# Altium project Blower_PCB.PrjPcb (part 1 of 2)
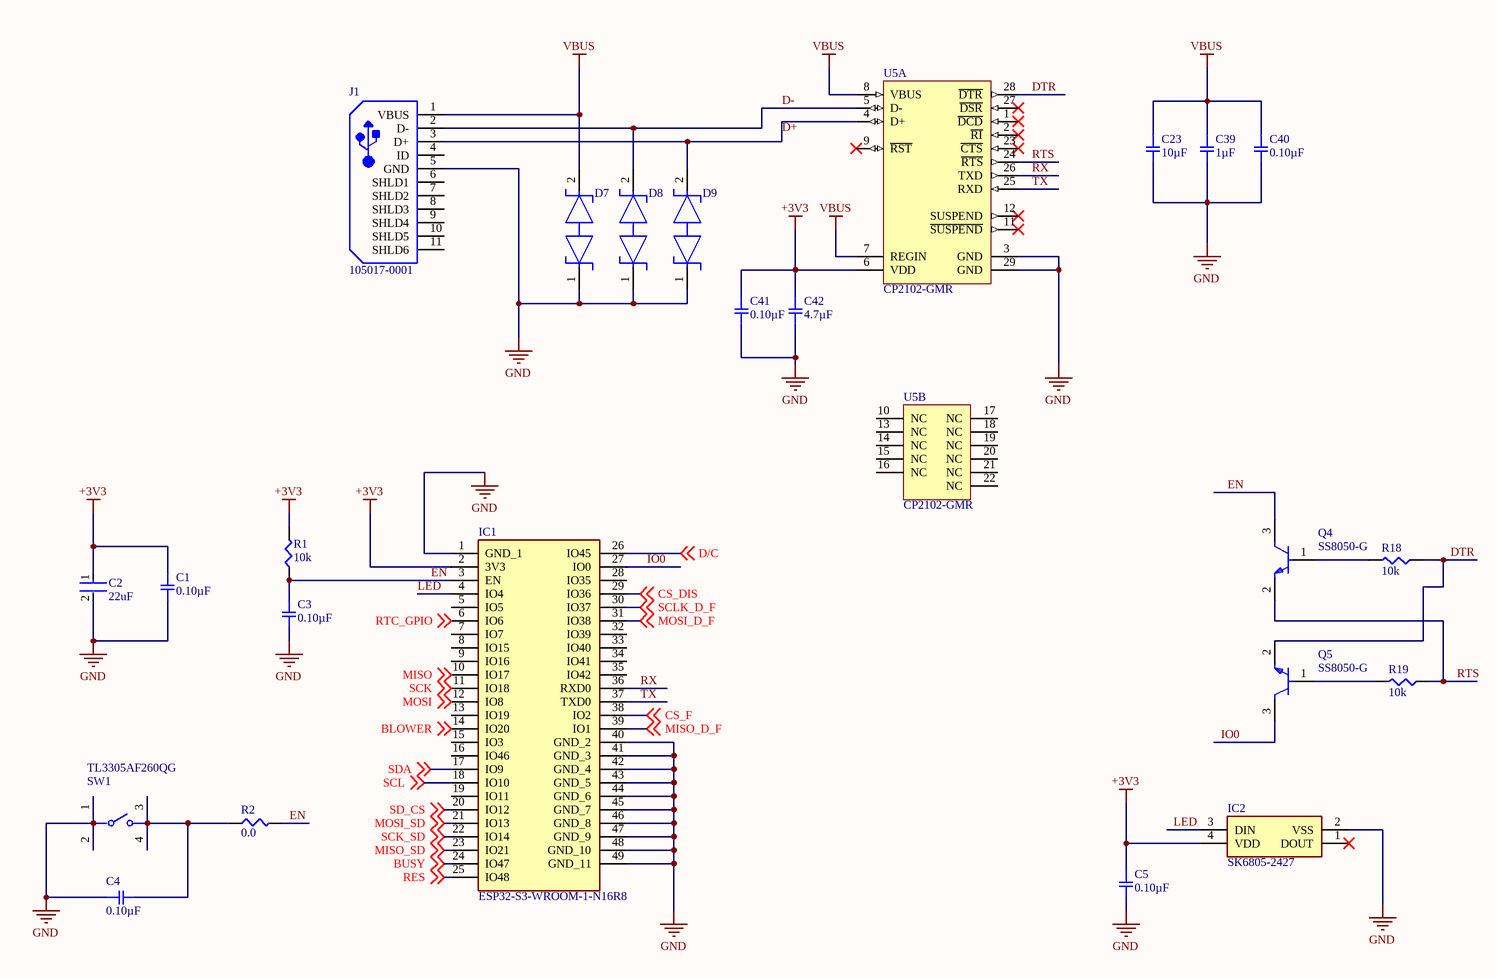
[diagram p0: MCU.SchDoc]
7 sheets, 136 parts. Net scope: global (net labels, ports and power ports of the same name join across sheets).
Board file: Copy of Blower_Pcb.PcbDoc
Sheets:
  MCU.SchDoc
  Sensor.SchDoc
  Other.SchDoc
  Display.SchDoc
  I2C_DRIVER.SchDoc
  RTC.SchDoc
  Power.SchDoc

## Sheet MCU.SchDoc
size 381 x 241 mm; SheetNumber: 1; SheetTotal: 7

### Parts
C1  0.10µF  [SMD-0402C]
C2  22uF  [FP-CL05A226MQ5N6J8-IPC_C]
C3  0.10µF  [SMD-0402C]
C4  0.10µF  [SMD-0402C]
C5  0.10µF  [SMD-0402C]
C23  10µF  [SMD-0402C]
C39  1µF  [SMD-0402C]
C40  0.10µF  [SMD-0402C]
C41  0.10µF  [SMD-0402C]
C42  4.7µF  [SMD-0402C]
D7  PD1E10B06DPYR  [FP-DPY0002A-MFG]  (value not drawn)
D8  PD1E10B06DPYR  [FP-DPY0002A-MFG]  (value not drawn)
D9  PD1E10B06DPYR  [FP-DPY0002A-MFG]  (value not drawn)
IC1  ESP32-S3-WROOM-1-N16R8  [ESP32S3WROOM1N16R8]
IC2  SK6805-2427  [SK68052427]
J1  105017-0001  [USB-MICRO-B_V]
Q4  SS8050-G  [FP-SS8050-G-MFG]
Q5  SS8050-G  [FP-SS8050-G-MFG]
R1  10k  [SMD-0402-RES]
R2  0.0  [SMD-0402-RES]
R18  10k  [SMD-0402-RES]
R19  10k  [SMD-0402-RES]
SW1  TL3305AF260QG  [FP-TL3305AF260QG-MFG]
U5  CP2102-GMR  [SLAB-QFN-28-3125x3125TP_M]  (parts A,B of 2)

### Nets
+3V3: C1.1 C2.1 C5.1 C41.1 C42.1 IC1.2(3V3) IC2.4(VDD) R1.2 U5.6(VDD)
GND: C1.2 C2.2 C3.2 C4.1 C5.2 C23.2 C39.2 C40.2 C41.2 C42.2 D7.1 D8.1 D9.1 IC1.1(GND_1) IC1.40(GND_2) IC1.41(GND_3) IC1.42(GND_4) IC1.43(GND_5) IC1.44(GND_6) IC1.45(GND_7) IC1.46(GND_8) IC1.47(GND_9) IC1.48(GND_10) IC1.49(GND_11) IC2.2(VSS) J1.5(GND) SW1.1 SW1.2 U5.3(GND) U5.29(GND)
VBUS: C23.1 C39.1 C40.1 D7.2 J1.1(VBUS) U5.7(REGIN) U5.8(VBUS)
BLOWER: IC1.14(IO20) ; off-sheet BLOWER
BUSY: IC1.24(IO47) ; off-sheet BUSY
CS_DIS: IC1.29(IO36) ; off-sheet CS_DIS
CS_F: IC1.38(IO2) ; off-sheet CS_F
D+: D9.2 J1.3(D+) U5.4(D+)
D-: D8.2 J1.2(D-) U5.5(D-)
D/C: IC1.26(IO45) ; off-sheet D/C
DTR: Q5.2(E) R18.1 U5.28(~{DTR})
EN: C3.1 IC1.3(EN) Q4.3(C) R1.1 R2.2
IO0: IC1.27(IO0) Q5.3(C)
LED: IC1.4(IO4) IC2.3(DIN)
MISO: IC1.10(IO17) ; off-sheet MISO
MISO_D_F: IC1.39(IO1) ; off-sheet MISO_D_F
MISO_SD: IC1.23(IO21) ; off-sheet MISO_SD
MOSI: IC1.12(IO8) ; off-sheet MOSI
MOSI_D_F: IC1.31(IO38) ; off-sheet MOSI_D_F
MOSI_SD: IC1.21(IO13) ; off-sheet MOSI_SD
RES: IC1.25(IO48) ; off-sheet RES
RTC_GPIO: IC1.6(IO6) ; off-sheet RTC_GPIO
RTS: Q4.2(E) R19.1 U5.24(~{RTS})
RX: IC1.36(RXD0) U5.26(TXD)
SCK: IC1.11(IO18) ; off-sheet SCK
SCK_SD: IC1.22(IO14) ; off-sheet SCK_SD
SCL: IC1.18(IO10) ; off-sheet SCL
SCLK_D_F: IC1.30(IO37) ; off-sheet SCLK_D_F
SD_CS: IC1.20(IO12) ; off-sheet SD_CS
SDA: IC1.17(IO9) ; off-sheet SDA
TX: IC1.37(TXD0) U5.25(RXD)
NetC4_2: C4.2 R2.1 SW1.3 SW1.4
NetQ4_1: Q4.1(B) R18.2
NetQ5_1: Q5.1(B) R19.2

Not connected (* = marked no-connect by the designer): IC1 5(IO5) 7(IO7) 8(IO15) 9(IO16) 13(IO19) 15(IO3) 16(IO46) 19(IO11) 28(IO35) 32(IO39) 33(IO40) 34(IO41) 35(IO42); IC2 1(DOUT)*; J1 4(ID) 6(SHLD1) 7(SHLD2) 8(SHLD3) 9(SHLD4) 10(SHLD5) 11(SHLD6); U5 1(~{DCD})* 2(~{RI})* 9(~{RST})* 10(NC) 11(~{SUSPEND})* 12(SUSPEND)* 13(NC) 14(NC) 15(NC) 16(NC) 17(NC) 18(NC) 19(NC) 20(NC) 21(NC) 22(NC) 23(~{CTS})* 27(~{DSR})*

### Library data of the parts
C1 C3-C5 C40 C41 = GCM155R71C104KA55D: CAP CER 0.1UF 16V X7R 0402; Manufacturer: Murata Electronics North America; Factory Stock: 0; Unit Price (USD): 0.1; Minimum Quantity: 1; Tolerance: ±10%; Datasheets: http://www.murata.com/~/media/webrenewal/support/library/catalog/products/capacitor/mlcc/c03e.ashx; Image: //media.digikey.com/Renders/Murata%20Renders/ZRB-SERIES-0402.jpg; Digi-Key Part Number: 490-4759-1-ND; Part Number: GCM155R71C104KA55D; Quantity Available: 734194; @ qty: 0; Packaging: Cut Tape (CT); Series: GCM; Part Status: Active; Value: 0.10µF; Voltage: 16V; Temperature Coefficient: X7R; Operating Temperature: -55°C ~ 125°C; Features: -; Ratings: AEC-Q200; Applications: Automotive; Mounting Type: Surface Mount, MLCC; Package / Case: 0402 (1005 Metric); Size / Dimension: 0.039" L x 0.020" W (1.00mm x 0.50mm); Height - Seated (Max): -; Thickness (Max): 0.022" (0.55mm); Lead Spacing: -; Lead Style: -
C2 = CMP-13271-000001-1: CAP CER 22UF 6.3V X5R 0402; Manufacturer Part Number: CL05A226MQ5N6J8; Manufacturer: Samsung Electro-Mechanics; Material: Ceramic; Temperature Coefficient: 15%; Tolerance: 20%; Ipc Land Pattern Name: CAPC10050X50; Lead Free: Yes; Temperature Characteristic: X5R; Temperature: -55°C to +85°C; RoHS: TRUE; ComponentLink2Description: Datasheet; Device Class L3: Ceramic Capacitors; Device Class L1: Passive Components; Value: 22uF; Temperature Range High: +85°C; Automotive: No; Voltage Rating: 6.3V; Package: 0402; Category: Cap; Device Class L2: Capacitors; Height: 0.55mm; ComponentLink2URL: http://www.samsungsem.com/kr/support/library/product-catalog/__icsFiles/afieldfile/2018/11/28/MLCC.pdf; Temperature Range Low: -55°C; Octopart: https://octopart.com/cl05a226mq5n6j8-samsung-82337113; Capacitance: 22uF; Digikey Description: CAP CER 22UF 6.3V X5R 0402
C23 = ZRB15XR60J106ME12D: CAP CER 10UF 6.3V X5R 0402; Manufacturer: Murata Electronics North America; Factory Stock: 0; Unit Price (USD): 0.25; Minimum Quantity: 1; Tolerance: ±20%; Datasheets: http://psearch.en.murata.com/capacitor/product/ZRB15XR60J106ME12%23.pdf; Image: //media.digikey.com/Renders/Murata%20Renders/ZRB-SERIES-0402.jpg; Digi-Key Part Number: 490-13251-1-ND; Part Number: ZRB15XR60J106ME12D; Quantity Available: 8000; @ qty: 0; Packaging: Cut Tape (CT); Series: ZRB; Part Status: Active; Value: 10µF; Voltage: 6.3V; Temperature Coefficient: X5R; Operating Temperature: -55°C ~ 85°C; Features: Derating Recommended, Interposer Termination; Ratings: -; Applications: Acoustic Noise Reduction; Mounting Type: Surface Mount, MLCC; Package / Case: 0402 (1005 Metric); Size / Dimension: 0.039" L x 0.020" W (1.00mm x 0.50mm); Height - Seated (Max): -; Thickness (Max): 0.031" (0.80mm); Lead Spacing: -; Lead Style: -
C39 = GCM155C71A105KE38D: CAP CER 1UF 10V X7S 0402; Manufacturer: Murata Electronics North America; Factory Stock: 0; Unit Price (USD): 0.12; Minimum Quantity: 1; Tolerance: ±10%; Datasheets: http://www.murata.com/~/media/webrenewal/support/library/catalog/products/capacitor/mlcc/c03e.ashx; Image: //media.digikey.com/Renders/Murata%20Renders/ZRB-SERIES-0402.jpg; Digi-Key Part Number: 490-13409-1-ND; Part Number: GCM155C71A105KE38D; Quantity Available: 7240; @ qty: 0; Packaging: Cut Tape (CT); Series: GCM; Part Status: Active; Value: 1µF; Voltage: 10V; Temperature Coefficient: X7S; Operating Temperature: -55°C ~ 125°C; Features: -; Ratings: AEC-Q200; Applications: Automotive; Mounting Type: Surface Mount, MLCC; Package / Case: 0402 (1005 Metric); Size / Dimension: 0.039" L x 0.020" W (1.00mm x 0.50mm); Height - Seated (Max): -; Thickness (Max): 0.022" (0.55mm); Lead Spacing: -; Lead Style: -
C42 = ZRB15XR61A475KE01D: CAP CER 4.7UF 10V X5R 0402; Manufacturer: Murata Electronics North America; Factory Stock: 0; Unit Price (USD): 0.28; Minimum Quantity: 1; Tolerance: ±10%; Datasheets: http://search.murata.co.jp/Ceramy/image/img/A01X/G101/ENG/ZRB15XR61A475KE01-01.pdf; Image: //media.digikey.com/Renders/Murata%20Renders/ZRB-SERIES-0402.jpg; Digi-Key Part Number: 490-13252-1-ND; Part Number: ZRB15XR61A475KE01D; Quantity Available: 23076; @ qty: 0; Packaging: Cut Tape (CT); Series: ZRB; Part Status: Active; Value: 4.7µF; Voltage: 10V; Temperature Coefficient: X5R; Operating Temperature: -55°C ~ 85°C; Features: Derating Recommended, Interposer Termination; Ratings: -; Applications: Acoustic Noise Reduction; Mounting Type: Surface Mount, MLCC; Package / Case: 0402 (1005 Metric); Size / Dimension: 0.039" L x 0.020" W (1.00mm x 0.50mm); Height - Seated (Max): -; Thickness (Max): 0.031" (0.80mm); Lead Spacing: -; Lead Style: -
D7-D9 = CMP-0326-00004-4: TVS DIODE 5.5V 14V 2X1SON; Leakage Current: 100nA; Min Breakdown Voltage: 6V; Number of Channels: 1; ESD Protection: Yes; Power Line Protection: No; Test Current: 1mA; Interface: GPIO; Element Configuration: Single; Peak Pulse Current: 5A; Direction: Bidirectional; Peak Pulse Power: 90W; Capacitance: 12pF; Composition: Zener; Packaging: Tape and Reel; Number of Pins: 2; Breakdown Voltage: 6V; Radiation Hardening: No; Min Operating Temperature: -40°C; Contact Plating: Gold; Lead Free: Lead Free; Height: 0.35mm; REACH SVHC: No SVHC; Case/Package: 0402; Max Operating Temperature: 125°C; Width: 0.7mm; Clamping Voltage: 14V; Package Quantity: 1; Max Reverse Leakage Current: 100nA; Working Voltage: 5.5V; Length: 1.1mm; Number of Bidirectional Channels: 1; Reverse Standoff Voltage: 5.5V
IC1 = ESP32-S3-WROOM-1-N16R8: Integrated Circuit; Manufacturer_Name: Espressif Systems; Datasheet Link: https://www.espressif.com/sites/default/files/documentation/esp32-s3-wroom-1_wroom-1u_datasheet_en.pdf; Height: 3.25mm; Manufacturer_Part_Number: ESP32-S3-WROOM-1-N16R8; Mouser Part Number: 356-ESP32S3WRM1N16R8; Mouser Price/Stock: https://www.mouser.co.uk/ProductDetail/Espressif-Systems/ESP32-S3-WROOM-1-N16R8?qs=Li%252BoUPsLEnvQc9gW6AMhZg%3D%3D
IC2 = SK6805-2427: Integrated Circuit; Manufacturer_Name: Adafruit; Datasheet Link: https://cdn-shop.adafruit.com/product-files/3484/3484_Datasheet.pdf; Height: 1.1mm; Manufacturer_Part_Number: SK6805-2427
J1 = CMP-2000-05827-1: Micro-USB B Receptacle, Right Angle, Bottom Mount, Surface Mount, with Solder Tabs, -30 to 85 degC, 5-Pin USB, RoHS, Tape and Reel; Manufacturer: Molex; Featured Product: Micro-USBConnectorsUSBConnectors; Other Names: WM1399DKR; Package Version: Rev. F, 12/2012; Number of Contacts: 5; Connector Type: USB-microB; Catalog Drawings: 1050170001; 3D Model: 105017-0001.stp; Mating Products: WM17145-ND-CABLEMICROUSBBTOSTDA1.0MWM17147-ND-CABLEMICROUSBBTOSTDA2.0MWM17146-ND-CABLEMICROUSBBTOSTDA1.5M; PCN Assembly/Origin: ResinSupplier21/Oct/2015; Voltage - Max: 30V; Online Catalog: Molex-MicroUSB; Manufacturer URL: http://www.molex.com/; Package Description: 5-Leads USB, Micro B, Body 7.5 x 5 mm, Pitch 0.65 mm; Datasheet URL: http://www.molex.com/elqNow/elqRedir.htm?ref=http://www.molex.com/webdocs/datasheets/pdf/en-us/1050170001_IO_CONNECTORS.pdf; Ingress Protection: -; Datasheet Version: 03/2016; Mounting Type: BoardCutout,SurfaceMount,RightAngle; Circuits: 5; Standard Package: 1; Package Reference: MICRO-B; Package URL: http://www.molex.com/pdm_docs/sd/1050170001_sd.pdf; Category: Connectors,Interconnects; Series: -; RoHS Information: 1050170001CertofCompliance; Features: Shielded,SolderRetention; Family: USB,DVI,HDMIConnectors; Specifications: -; Gender: Receptacle; Packaging: Digi-Reel®; Mounting Technology: SurfaceMount
Q4 Q5 = CMP-20235-000001-1: NPN TRANSISTOR 1.5A 40V SOT-23 R; Transition Frequency: 100MHz; Max Breakdown Voltage: 25V; Collector Emitter Voltage (VCEO): 400mV; Max Power Dissipation: 300mW; Max Collector Current: 1.5A; Case/Package: TO-236-3; Packaging: Tape and Reel; RoHS Compliant: Yes; Mount: Surface Mount; Collector Emitter Breakdown Voltage: 25V
R1 R18 R19 = ERJ-2GEJ103X: RES SMD 10K OHM 5% 1/10W 0402; Manufacturer: Panasonic Electronic Components; Factory Stock: 0; Unit Price (USD): 0.00350; @ qty: 1500; Minimum Quantity: 1; Power (Watts): 0.1W, 1/10W; Temperature Coefficient: ±200ppm/°C; Part Number: ERJ-2GEJ103X; Datasheets: http://industrial.panasonic.com/www-cgi/jvcr13pz.cgi?E+PZ+3+AOA0001+ERJ2GEJ103X+7+WW; Image: //media.digikey.com/Photos/Panasonic%20Photos/ERJ-PA2-Series.jpg; Digi-Key Part Number: P10KJCT-ND; Quantity Available: 2560215; Packaging: Cut Tape (CT); Series: ERJ; Part Status: Active; Value: 10k; Tolerance: ±5%; Composition: Thick Film; Features: Automotive AEC-Q200; Operating Temperature: -55°C ~ 155°C; Package / Case: 0402 (1005 Metric); Supplier Device Package: 0402; Size / Dimension: 0.039" L x 0.020" W (1.00mm x 0.50mm); Height - Seated (Max): 0.016" (0.40mm); Number of Terminations: 2; Failure Rate: -
R2 = ERJ-2GE0R00X: RES SMD 0.0OHM JUMPER 1/10W 0402; Manufacturer: Panasonic Electronic Components; Factory Stock: 0; Unit Price (USD): 0.00384; @ qty: 1500; Minimum Quantity: 1; Power (Watts): 0.1W, 1/10W; Part Number: ERJ-2GE0R00X; Datasheets: http://industrial.panasonic.com/www-cgi/jvcr13pz.cgi?E+PZ+3+AOA0001+ERJ2GE0R00X+7+WW; Image: //media.digikey.com/Photos/Panasonic%20Photos/ERJ-PA2-Series.jpg; Digi-Key Part Number: P0.0JCT-ND; Quantity Available: 3152483; Packaging: Cut Tape (CT); Series: ERJ; Part Status: Active; Value: 0.0; Tolerance: Jumper; Composition: Thick Film; Features: Automotive AEC-Q200; Temperature Coefficient: -; Operating Temperature: -55°C ~ 155°C; Package / Case: 0402 (1005 Metric); Supplier Device Package: 0402; Size / Dimension: 0.039" L x 0.020" W (1.00mm x 0.50mm); Height - Seated (Max): 0.016" (0.40mm); Number of Terminations: 2; Failure Rate: -
SW1 = CMP-17879-000010-1: SWITCH TACTILE SPST-NO 50MA 12V; Mechanical Life: 200000Cycles; Switch Function: Off-Mom; Actuator Type: Standard; Operating Force: 260gf; Illumination Type: Non-Illuminated; Switch Travel: 0.2mm; Throw Configuration: SPST; Min Operating Temperature: -20°C; Max Operating Temperature: 70°C; Lead Free: Lead Free; Mount: Surface Mount; Packaging: Tape and Reel; Termination: Gull Wing
U5 = CMP-2000-04924-1: Single-Chip USB to URAT Bridge, 3.3 V, -40 to 85 degC, 28-Pin QFN, RoHS, Tape and Reel; Manufacturer: Silicon Labs; Interface Circuit Standard 1: RS-232; Transmitter and Receiver FIFO Counter: No; Supply Current: 26mA; Operating Supply Voltage (Min): 3V; Operating Supply Voltage (Typ): 3.3V; Data Rate: 1000kbps; Operating Supply Voltage (Max): 3.6V; Number of Channels: 1; Package URL: http://www.silabs.com/Support%20Documents/TechnicalDocs/C8051T61x.pdf; Operating Temperature (Max): 85C; Datasheet URL: http://www.mouser.com/ds/2/368/CP2102-9-247052.pdf; Operating Temperature Classification: Industrial; Operating Temperature (Min): -40C; Package Description: 28-Pin Quad-Flat No-Leads Package, Body 5 x 5 mm, Pitch 0.5 mm; Manufacturer URL: http://www.silabs.com/; Rad Hardened: No; Package Reference: QFN-28; Pin Count: 28; Packaging: TapeandReel; Mounting: SurfaceMount; Package Type: QFNEP; Datasheet Version: Rev. 1.6, 12/2013

## Sheet Sensor.SchDoc
size A4; SheetNumber: 2; SheetTotal: 7
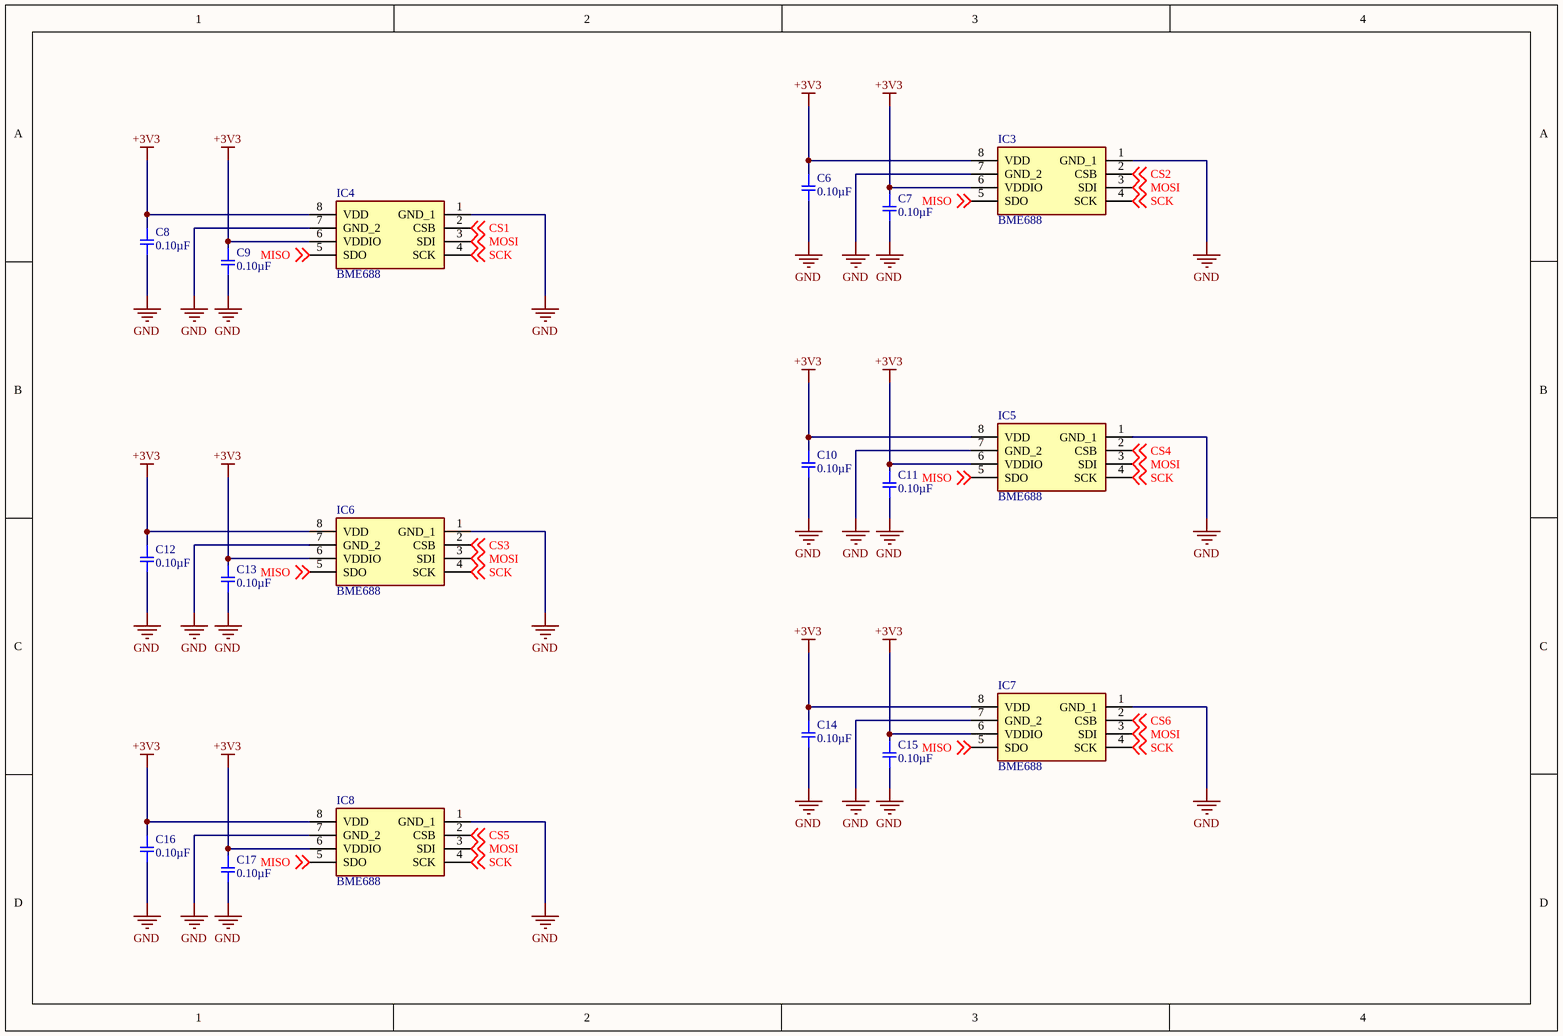
[diagram p1: Sensor.SchDoc]

### Parts
C6  0.10µF  [SMD-0402C]
C7  0.10µF  [SMD-0402C]
C8  0.10µF  [SMD-0402C]
C9  0.10µF  [SMD-0402C]
C10  0.10µF  [SMD-0402C]
C11  0.10µF  [SMD-0402C]
C12  0.10µF  [SMD-0402C]
C13  0.10µF  [SMD-0402C]
C14  0.10µF  [SMD-0402C]
C15  0.10µF  [SMD-0402C]
C16  0.10µF  [SMD-0402C]
C17  0.10µF  [SMD-0402C]
IC3  BME688  [BME688]
IC4  BME688  [BME688]
IC5  BME688  [BME688]
IC6  BME688  [BME688]
IC7  BME688  [BME688]
IC8  BME688  [BME688]

### Nets
+3V3: C6.1 C7.1 C8.1 C9.1 C10.1 C11.1 C12.1 C13.1 C14.1 C15.1 C16.1 C17.1 IC3.6(VDDIO) IC3.8(VDD) IC4.6(VDDIO) IC4.8(VDD) IC5.6(VDDIO) IC5.8(VDD) IC6.6(VDDIO) IC6.8(VDD) IC7.6(VDDIO) IC7.8(VDD) IC8.6(VDDIO) IC8.8(VDD)
GND: C6.2 C7.2 C8.2 C9.2 C10.2 C11.2 C12.2 C13.2 C14.2 C15.2 C16.2 C17.2 IC3.1(GND_1) IC3.7(GND_2) IC4.1(GND_1) IC4.7(GND_2) IC5.1(GND_1) IC5.7(GND_2) IC6.1(GND_1) IC6.7(GND_2) IC7.1(GND_1) IC7.7(GND_2) IC8.1(GND_1) IC8.7(GND_2)
CS1: IC4.2(CSB) ; off-sheet CS1
CS2: IC3.2(CSB) ; off-sheet CS2
CS3: IC6.2(CSB) ; off-sheet CS3
CS4: IC5.2(CSB) ; off-sheet CS4
CS5: IC8.2(CSB) ; off-sheet CS5
CS6: IC7.2(CSB) ; off-sheet CS6
MISO: IC3.5(SDO) IC4.5(SDO) IC5.5(SDO) IC6.5(SDO) IC7.5(SDO) IC8.5(SDO) ; off-sheet MISO
MOSI: IC3.3(SDI) IC4.3(SDI) IC5.3(SDI) IC6.3(SDI) IC7.3(SDI) IC8.3(SDI) ; off-sheet MOSI
SCK: IC3.4(SCK) IC4.4(SCK) IC5.4(SCK) IC6.4(SCK) IC7.4(SCK) IC8.4(SCK) ; off-sheet SCK

### Library data of the parts
C6-C17 = GCM155R71C104KA55D: as C1 on sheet MCU; Datasheets: http://www.murata.com/~/media/webrenewal/support/library/catalog/products/capacitor/mlcc/c03e.ashx; Image: //media.digikey.com/Renders/Murata%20Renders/ZRB-SERIES-0402.jpg; Digi-Key Part Number: 490-4759-1-ND; Part Number: GCM155R71C104KA55D; Quantity Available: 734194; @ qty: 0; Packaging: Cut Tape (CT); Series: GCM; Part Status: Active; Value: 0.10µF; Voltage: 16V; Temperature Coefficient: X7R; Operating Temperature: -55°C ~ 125°C; Features: -; Ratings: AEC-Q200; Applications: Automotive; Mounting Type: Surface Mount, MLCC; Package / Case: 0402 (1005 Metric); Size / Dimension: 0.039" L x 0.020" W (1.00mm x 0.50mm); Height - Seated (Max): -; Thickness (Max): 0.022" (0.55mm); Lead Spacing: -; Lead Style: -
IC3-IC8 = BME688: Integrated Circuit; Manufacturer_Name: BOSCH; Datasheet Link: https://www.bosch-sensortec.com/media/boschsensortec/downloads/datasheets/bst-bme688-ds000.pdf; Height: 1mm; Manufacturer_Part_Number: BME688; Mouser Part Number: 262-BME688; Mouser Price/Stock: https://www.mouser.co.uk/ProductDetail/Bosch-Sensortec/BME688?qs=IS%252B4QmGtzzqQoVDscqwx3A%3D%3D; Arrow Part Number: BME688; Arrow Price/Stock: https://www.arrow.com/en/products/bme688/bosch?region=europe

## Sheet Other.SchDoc
size A4; SheetNumber: 3; SheetTotal: 7
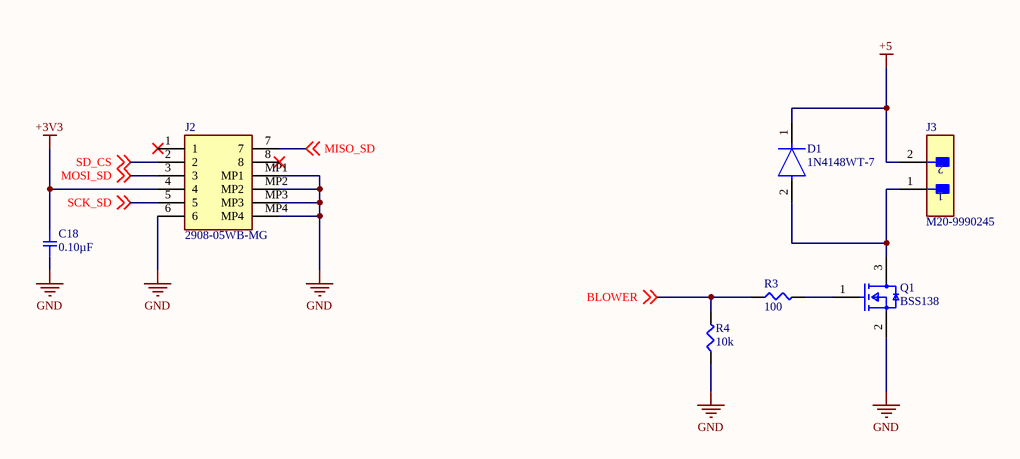
[diagram p2: Other.SchDoc]

### Parts
C18  0.10µF  [SMD-0402C]
D1  1N4148WT-7  [FP-SOD523-MFG]
J2  2908-05WB-MG  [290805WBMG]
J3  M20-9990245  [FP-M20-9990245-MFG]
Q1  BSS138  [FP-318-08-IPC_A]
R3  100  [SMD-0402-RES]
R4  10k  [SMD-0402-RES]

### Nets
+3V3: C18.1 J2.4
+5: D1.1(C) J3.2
GND: C18.2 J2.6 J2.MP1 J2.MP2 J2.MP3 J2.MP4 Q1.2(S) R4.1
BLOWER: R3.1 R4.2 ; off-sheet BLOWER
MISO_SD: J2.7 ; off-sheet MISO_SD
MOSI_SD: J2.3 ; off-sheet MOSI_SD
SCK_SD: J2.5 ; off-sheet SCK_SD
SD_CS: J2.2 ; off-sheet SD_CS
NetD1_2: D1.2(A) J3.1 Q1.3(D)
NetQ1_1: Q1.1(G) R3.2

Not connected (* = marked no-connect by the designer): J2 1* 8*

### Library data of the parts
C18 = GCM155R71C104KA55D: as C1 on sheet MCU; Datasheets: http://www.murata.com/~/media/webrenewal/support/library/catalog/products/capacitor/mlcc/c03e.ashx; Image: //media.digikey.com/Renders/Murata%20Renders/ZRB-SERIES-0402.jpg; Digi-Key Part Number: 490-4759-1-ND; Part Number: GCM155R71C104KA55D; Quantity Available: 734194; @ qty: 0; Packaging: Cut Tape (CT); Series: GCM; Part Status: Active; Value: 0.10µF; Voltage: 16V; Temperature Coefficient: X7R; Operating Temperature: -55°C ~ 125°C; Features: -; Ratings: AEC-Q200; Applications: Automotive; Mounting Type: Surface Mount, MLCC; Package / Case: 0402 (1005 Metric); Size / Dimension: 0.039" L x 0.020" W (1.00mm x 0.50mm); Height - Seated (Max): -; Thickness (Max): 0.022" (0.55mm); Lead Spacing: -; Lead Style: -
D1 = CMP-2000-05518-3: DIODE GEN PURP 80V 125MA SOD523; Power Rating: 150mW; Peak Non-Repetitive Surge Current: 2A; Forward Voltage: 1.25V; Reverse Recovery Time: 4ns; Peak Reverse Current: 1uA; Max Repetitive Reverse Voltage (Vrrm): 100V; Capacitance: 2pF; Polarity: Standard; Element Configuration: Single; Forward Current: 250mA; Lead Free: Lead Free; Packaging: Tape and Reel; Length: 0.9mm; Min Operating Temperature: -65°C; Current Rating: 125mA; Max Reverse Voltage (DC): 80V; Width: 1.3mm; Package Quantity: 3000; Output Current: 125mA; Power Dissipation: 150mW; Max Operating Temperature: 150°C; Radiation Hardening: No; Average Rectified Current: 125mA; Height: 0.65mm; Voltage Rating (DC): 80V; Max Surge Current: 2A; Weight: 3.5E-05oz; Recovery Time: 4ns; Max Forward Surge Current (Ifsm): 2A; Contact Plating: Tin; Number of Pins: 2; Mount: Surface Mount; REACH SVHC: No SVHC
J2 = 2908-05WB-MG: Connector; Manufacturer_Name: 3M; Datasheet Link: https://componentsearchengine.com/Datasheets/1/2908-05WB-MG.pdf; Height: 1.85mm; Manufacturer_Part_Number: 2908-05WB-MG; Mouser Part Number: 517-2908-05WB-MG; Mouser Price/Stock: https://www.mouser.co.uk/ProductDetail/3M-Electronic-Solutions-Division/2908-05WB-MG?qs=vnwGVgFuQiZPJoOt79ALlw%3D%3D; Arrow Part Number: 2908-05WB-MG; Arrow Price/Stock: https://www.arrow.com/en/products/2908-05wb-mg/3m?region=europe
J3 = CMP-15831-000105-1: CONN HEADER VERT 2POS 2.54MM; Working Voltage: 750V; Gender: Male; Number of Poles: 2; Current Rating: 3A; Mated Stacking Heights: 16.54mm; Contact Resistance: 25mR; Connector Type: Male Pin; Insulation Resistance: 10GR; Mating Cycles: 300; Voltage: 50V; Flammability Rating: UL94 V-0; Pitch: 2.54mm; Series: M20; Number of Contacts: 2; Height: 0.12inch; Min Operating Temperature: -40°C; Contact Finish - Mating: GOLD; Number of Positions: 2; Number of Rows: 1; Packaging: Bulk; Package Quantity: 1000; Voltage Rating (AC): 750V; Current: 3A; Mount: Through Hole; Case/Package: SIL; Orientation: Straight; Contact Shape: Square; Weight: 0.25lb; Radiation Hardening: No; Fastening Type: Pull; Length: 5.08mm; Depth: 2.54mm; Contact Mating Length: 0.24inch; Housing Material: Nylon; Reach SVHC Compliant: Yes; Insulation Material: Nylon; Color: Black; Width: 0.25inch; Insulation Color: Black; Contact Material: Brass; Contact Type: Male Pin; Termination: Solder; Max Operating Temperature: 105°C; Contact Plating: Gold; Housing Color: Black; Max Current Rating: 3A; Lead Pitch: 2.54mm
Q1 = CMP-07173-000101-1: MOSFET N-CH 50V 220MA SOT-23; Turn-Off Delay Time: 20ns; Element Configuration: Single; Rds On Max: 3.5R; Gate to Source Voltage (Vgs): 20V; Threshold Voltage: 1.3V; Number of Elements: 1; Power Dissipation: 360mW; Rise Time: 9ns; Turn-On Delay Time: 2.5ns; Input Capacitance: 27pF; On-State Resistance: 6R; Lead Free: Lead Free; Length: 2.92mm; Width: 1.3mm; Drain to Source Breakdown Voltage: 50V; Min Operating Temperature: -55°C; REACH SVHC: No SVHC; Packaging: Tape and Reel; Radiation Hardening: No; Height: 0.93mm; Drain to Source Voltage (Vdss): 50V; Current Rating: 220mA; Voltage Rating (DC): 50V; Weight: 0.03g; Continuous Drain Current (ID): 220mA; Number of Pins: 3; Nominal Vgs: 1.3V; Max Power Dissipation: 360mW; Fall Time: 9ns; Drain to Source Resistance: 3.5R; Contact Plating: Tin; Case/Package: SOT-23; Package Quantity: 1; Dual Supply Voltage: 50V; Mount: Surface Mount; Termination: SMD/SMT; Max Operating Temperature: 150°C
R3 = ERJ-2RKF1000X: RES SMD 100 OHM 1% 1/10W 0402; Manufacturer: Panasonic Electronic Components; Factory Stock: 0; Unit Price (USD): 0.00496; @ qty: 1500; Minimum Quantity: 1; Power (Watts): 0.1W, 1/10W; Temperature Coefficient: ±100ppm/°C; Part Number: ERJ-2RKF1000X; Datasheets: http://industrial.panasonic.com/www-cgi/jvcr13pz.cgi?E+PZ+3+AOA0002+ERJ2RKF1000X+7+WW; Image: //media.digikey.com/Photos/Panasonic%20Photos/ERJ-PA2-Series.jpg; Digi-Key Part Number: P100LCT-ND; Quantity Available: 2283953; Packaging: Cut Tape (CT); Series: ERJ; Part Status: Active; Value: 100; Tolerance: ±1%; Composition: Thick Film; Features: Automotive AEC-Q200; Operating Temperature: -55°C ~ 155°C; Package / Case: 0402 (1005 Metric); Supplier Device Package: 0402; Size / Dimension: 0.039" L x 0.020" W (1.00mm x 0.50mm); Height - Seated (Max): 0.016" (0.40mm); Number of Terminations: 2; Failure Rate: -
R4 = ERJ-2GEJ103X: as R1 on sheet MCU; Part Number: ERJ-2GEJ103X; Datasheets: http://industrial.panasonic.com/www-cgi/jvcr13pz.cgi?E+PZ+3+AOA0001+ERJ2GEJ103X+7+WW; Image: //media.digikey.com/Photos/Panasonic%20Photos/ERJ-PA2-Series.jpg; Digi-Key Part Number: P10KJCT-ND; Quantity Available: 2560215; Packaging: Cut Tape (CT); Series: ERJ; Part Status: Active; Value: 10k; Tolerance: ±5%; Composition: Thick Film; Features: Automotive AEC-Q200; Operating Temperature: -55°C ~ 155°C; Package / Case: 0402 (1005 Metric); Supplier Device Package: 0402; Size / Dimension: 0.039" L x 0.020" W (1.00mm x 0.50mm); Height - Seated (Max): 0.016" (0.40mm); Number of Terminations: 2; Failure Rate: -

## Sheet Display.SchDoc
size A4; SheetNumber: 4; SheetTotal: 7
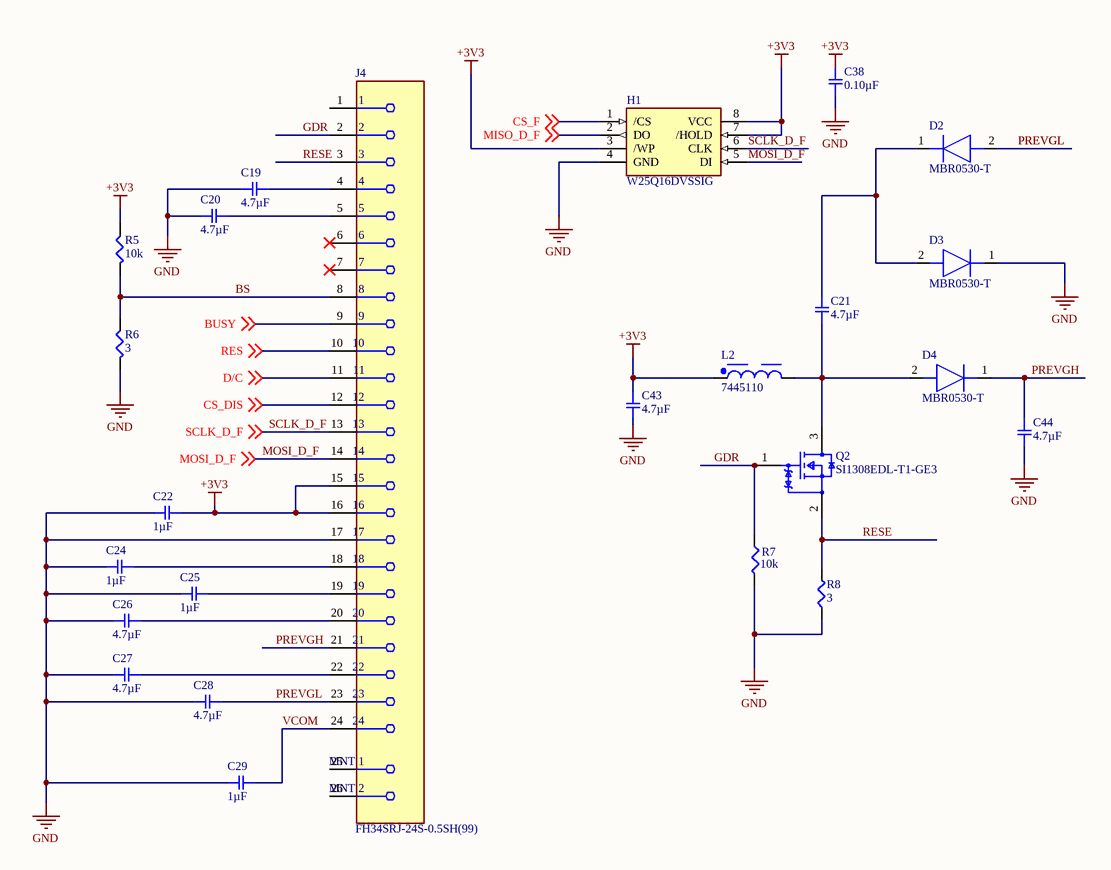
[diagram p3: Display.SchDoc]

### Parts
C19  4.7µF  [SMD-0402C]
C20  4.7µF  [SMD-0402C]
C21  4.7µF  [SMD-0402C]
C22  1µF  [SMD-0402C]
C24  1µF  [SMD-0402C]
C25  1µF  [SMD-0402C]
C26  4.7µF  [SMD-0402C]
C27  4.7µF  [SMD-0402C]
C28  4.7µF  [SMD-0402C]
C29  1µF  [SMD-0402C]
C38  0.10µF  [SMD-0402C]
C43  4.7µF  [SMD-0402C]
C44  4.7µF  [SMD-0402C]
D2  MBR0530-T  [SOD3716X135N]
D3  MBR0530-T  [SOD3716X135N]
D4  MBR0530-T  [SOD3716X135N]
H1  W25Q16DVSSIG  [SOIC127P790X216-8N]
J4  FH34SRJ-24S-0.5SH(99)  [FP-FH34SRJ-24S-0_5SH_99-MFG]
L2  7445110  [WE-PD3_Type S]
Q2  SI1308EDL-T1-GE3  [FP-5549-MFG]
R5  10k  [SMD-0402-RES]
R6  3  [SMD-0402-RES]
R7  10k  [SMD-0402-RES]
R8  3  [SMD-0402-RES]

### Nets
+3V3: C22.1 C38.1 C43.1 H1.3(/WP) H1.7(/HOLD) H1.8(VCC) J4.15 J4.16 L2.1 R5.1
GND: C19.2 C20.2 C22.2 C24.2 C25.2 C26.2 C27.2 C28.2 C29.2 C38.2 C43.2 C44.2 D3.1(K) H1.4(GND) J4.17 R6.2 R7.2 R8.1
BS: J4.8 R5.2 R6.1
BUSY: J4.9 ; off-sheet BUSY
CS_DIS: J4.12 ; off-sheet CS_DIS
CS_F: H1.1(/CS) ; off-sheet CS_F
D/C: J4.11 ; off-sheet D/C
GDR: J4.2 Q2.1(G) R7.1
MISO_D_F: H1.2(DO) ; off-sheet MISO_D_F
MOSI_D_F: H1.5(DI) J4.14 ; off-sheet MOSI_D_F
PREVGH: C44.1 D4.1(K) J4.21
PREVGL: C28.1 D2.2(A) J4.23
RES: J4.10 ; off-sheet RES
RESE: J4.3 Q2.2(S) R8.2
SCLK_D_F: H1.6(CLK) J4.13 ; off-sheet SCLK_D_F
VCOM: C29.1 J4.24
NetC19_1: C19.1 J4.4
NetC20_1: C20.1 J4.5
NetC21_1: C21.1 D4.2(A) L2.2 Q2.3(D)
NetC21_2: C21.2 D2.1(K) D3.2(A)
NetC24_1: C24.1 J4.18
NetC25_1: C25.1 J4.19
NetC26_1: C26.1 J4.20
NetC27_1: C27.1 J4.22

Not connected (* = marked no-connect by the designer): J4 1 6* 7* 25(MNT_1) 26(MNT_2)

### Library data of the parts
C19-C21 C26-C28 = ZRB15XR61A475ME01D: CAP CER 4.7UF 10V X5R 0402; Manufacturer: Murata Electronics North America; Factory Stock: 0; Unit Price (USD): 0.36; Minimum Quantity: 1; Tolerance: ±20%; Datasheets: http://search.murata.co.jp/Ceramy/image/img/A01X/G101/ENG/ZRB15XR61A475ME01-01.pdf; Image: //media.digikey.com/Renders/Murata%20Renders/ZRB-SERIES-0402.jpg; Digi-Key Part Number: 490-10984-1-ND; Part Number: ZRB15XR61A475ME01D; Quantity Available: 53897; @ qty: 0; Packaging: Cut Tape (CT); Series: ZRB; Part Status: Active; Value: 4.7µF; Voltage: 10V; Temperature Coefficient: X5R; Operating Temperature: -55°C ~ 85°C; Features: Derating Recommended, Interposer Termination; Ratings: -; Applications: Acoustic Noise Reduction; Mounting Type: Surface Mount, MLCC; Package / Case: 0402 (1005 Metric); Size / Dimension: 0.039" L x 0.020" W (1.00mm x 0.50mm); Height - Seated (Max): -; Thickness (Max): 0.031" (0.80mm); Lead Spacing: -; Lead Style: -
C22 C24 C25 C29 = GRM155R61E105MA12D: CAP CER 1UF 25V X5R 0402; Manufacturer: Murata Electronics North America; Factory Stock: 0; Unit Price (USD): 0.1; Minimum Quantity: 1; Tolerance: ±20%; Datasheets: http://www.murata.com/~/media/webrenewal/support/library/catalog/products/capacitor/mlcc/c02e.pdf; Image: //media.digikey.com/Renders/Murata%20Renders/ZRB-SERIES-0402.jpg; Digi-Key Part Number: 490-10018-1-ND; Part Number: GRM155R61E105MA12D; Quantity Available: 32609; @ qty: 0; Packaging: Cut Tape (CT); Series: GRM; Part Status: Active; Value: 1µF; Voltage: 25V; Temperature Coefficient: X5R; Operating Temperature: -55°C ~ 85°C; Features: Derating Recommended; Ratings: -; Applications: General Purpose; Mounting Type: Surface Mount, MLCC; Package / Case: 0402 (1005 Metric); Size / Dimension: 0.039" L x 0.020" W (1.00mm x 0.50mm); Height - Seated (Max): -; Thickness (Max): 0.022" (0.55mm); Lead Spacing: -; Lead Style: -
C38 = GCM155R71C104KA55D: as C1 on sheet MCU; Datasheets: http://www.murata.com/~/media/webrenewal/support/library/catalog/products/capacitor/mlcc/c03e.ashx; Image: //media.digikey.com/Renders/Murata%20Renders/ZRB-SERIES-0402.jpg; Digi-Key Part Number: 490-4759-1-ND; Part Number: GCM155R71C104KA55D; Quantity Available: 734194; @ qty: 0; Packaging: Cut Tape (CT); Series: GCM; Part Status: Active; Value: 0.10µF; Voltage: 16V; Temperature Coefficient: X7R; Operating Temperature: -55°C ~ 125°C; Features: -; Ratings: AEC-Q200; Applications: Automotive; Mounting Type: Surface Mount, MLCC; Package / Case: 0402 (1005 Metric); Size / Dimension: 0.039" L x 0.020" W (1.00mm x 0.50mm); Height - Seated (Max): -; Thickness (Max): 0.022" (0.55mm); Lead Spacing: -; Lead Style: -
C43 C44 = ZRB15XR61A475KE01D: as C42 on sheet MCU; Datasheets: http://search.murata.co.jp/Ceramy/image/img/A01X/G101/ENG/ZRB15XR61A475KE01-01.pdf; Image: //media.digikey.com/Renders/Murata%20Renders/ZRB-SERIES-0402.jpg; Digi-Key Part Number: 490-13252-1-ND; Part Number: ZRB15XR61A475KE01D; Quantity Available: 23076; @ qty: 0; Packaging: Cut Tape (CT); Series: ZRB; Part Status: Active; Value: 4.7µF; Voltage: 10V; Temperature Coefficient: X5R; Operating Temperature: -55°C ~ 85°C; Features: Derating Recommended, Interposer Termination; Ratings: -; Applications: Acoustic Noise Reduction; Mounting Type: Surface Mount, MLCC; Package / Case: 0402 (1005 Metric); Size / Dimension: 0.039" L x 0.020" W (1.00mm x 0.50mm); Height - Seated (Max): -; Thickness (Max): 0.031" (0.80mm); Lead Spacing: -; Lead Style: -
D2-D4 = MBR0530-T: Diode; Manufacturer_Name: MCC; Datasheet Link: https://componentsearchengine.com/Datasheets/1/MBR0530-T.pdf; Height: 1.35mm; Manufacturer_Part_Number: MBR0530-T; Mouser Part Number: 833-MBR0530-T; Mouser Price/Stock: https://www.mouser.co.uk/ProductDetail/Micro-Commercial-Components-MCC/MBR0530-T?qs=9VyI4qLX4NTSXkb9ynzJnA%3D%3D
H1 = W25Q16DVSSIG: Hardware; Manufacturer_Name: Winbond; Datasheet Link: https://www.winbond.com/resource-files/da00-w25q16dv_f2.pdf; Height: 2.16mm; Manufacturer_Part_Number: W25Q16DVSSIG; Mouser Part Number: N/A; Mouser Price/Stock: https://www.mouser.co.uk/ProductDetail/Winbond/W25Q16DVSSIG?qs=rkhjVJ6%2F3EKYKn%2FdfCfLNQ%3D%3D
J4 = CMP-11609-000022-1: CONN FPC/FFC 24POS .5MM; Number of Positions: 24; Actuator Material: Nylon; Voltage Rating: 50V; Pitch: 0.02inch; Current Rating: 500mA; Contact Plating: Gold; Packaging: Tape and Reel; RoHS Compliant: Yes; Contact Material: Bronze; Min Operating Temperature: -55°C; Max Operating Temperature: 85°C; Number of Pins: 24; Housing Material: Polymer; Termination: Solder; Mount: Surface Mount; Flammability Rating: UL94 V-0
L2 = CMP-0227-00829-2: NexarPartId: 8917249; Self Resonant Frequency: 30MHz; Inductance: 10µH; Max DC Current: 1A; Saturation Current: 450mA; Resistance: 56mΩ; Test Frequency: 100kHz; Core Material: Ferrite; Inductance Tolerance: 20%; Shielding: Shielded; Max Operating Temperature: 125°C; RoHS: Compliant; Height - Seated (Max): 2.9972mm; Min Operating Temperature: -40°C; Height: 2.92mm; Length: 6.6mm; Width: 4.45mm; Mount: Surface Mount; Case/Package: Nonstandard; REACH SVHC: Unknown; Composition: Wirewound; Ambient Temperature Range Low: -40°C; Lead Free: Lead Free; DC Resistance (DCR): 56mΩ; Current Rating: 1A; Number of Pins: 2; Tolerance: 20%; RMS Current (Irms): 1A; Ambient Temperature Range High: 85°C; Packaging: Cut Tape (CT); Depth: 4.45mm
Q2 = CMP-02550-000099-2: MOSFET N-CH 30V 1.4A SC-70-3; Fall Time: 8ns; Max Power Dissipation: 500mW; Rise Time: 9ns; Rds On Max: 132mR; Power Dissipation: 400mW; Polarity: N-CHANNEL; Number of Elements: 1; Element Configuration: Single; Threshold Voltage: 600mV; Continuous Drain Current (ID): 1.5A; Gate to Source Voltage (Vgs): 12V; Turn-On Delay Time: 2ns; Input Capacitance: 105pF; Package Quantity: 3000; REACH SVHC: No SVHC; Mount: Surface Mount; Packaging: Tape and Reel; On-State Resistance: 132mR; Drain-source On Resistance-Max: 132mR; Lead Free: Lead Free; Drain to Source Breakdown Voltage: 30V; Series: TrenchFET®; Max Operating Temperature: 150°C; Drain to Source Resistance: 132mR; Radiation Hardening: No; Length: 2.2mm; Min Operating Temperature: -55°C; Number of Channels: 1; Drain to Source Voltage (Vdss): 30V; Number of Pins: 3; Turn-Off Delay Time: 8ns; Weight: 0.004395oz; RoHS Compliant: Yes; Width: 1.35mm; Height: 1mm; Case/Package: SOT-323
R5 R7 = ERJ-2GEJ103X: as R1 on sheet MCU; Part Number: ERJ-2GEJ103X; Datasheets: http://industrial.panasonic.com/www-cgi/jvcr13pz.cgi?E+PZ+3+AOA0001+ERJ2GEJ103X+7+WW; Image: //media.digikey.com/Photos/Panasonic%20Photos/ERJ-PA2-Series.jpg; Digi-Key Part Number: P10KJCT-ND; Quantity Available: 2560215; Packaging: Cut Tape (CT); Series: ERJ; Part Status: Active; Value: 10k; Tolerance: ±5%; Composition: Thick Film; Features: Automotive AEC-Q200; Operating Temperature: -55°C ~ 155°C; Package / Case: 0402 (1005 Metric); Supplier Device Package: 0402; Size / Dimension: 0.039" L x 0.020" W (1.00mm x 0.50mm); Height - Seated (Max): 0.016" (0.40mm); Number of Terminations: 2; Failure Rate: -
R6 R8 = ERJ-2GEJ3R0X: RES SMD 3 OHM 5% 1/10W 0402; Manufacturer: Panasonic Electronic Components; Factory Stock: 0; Unit Price (USD): 0.00350; @ qty: 1500; Minimum Quantity: 1; Power (Watts): 0.1W, 1/10W; Temperature Coefficient: -100/ +600ppm/°C; Part Number: ERJ-2GEJ3R0X; Datasheets: http://industrial.panasonic.com/www-cgi/jvcr13pz.cgi?E+PZ+3+AOA0001+ERJ2GEJ3R0X+7+WW; Image: //media.digikey.com/Photos/Panasonic%20Photos/ERJ-PA2-Series.jpg; Digi-Key Part Number: P3.0JCT-ND; Quantity Available: 212144; Packaging: Cut Tape (CT); Series: ERJ; Part Status: Active; Value: 3; Tolerance: ±5%; Composition: Thick Film; Features: Automotive AEC-Q200; Operating Temperature: -55°C ~ 155°C; Package / Case: 0402 (1005 Metric); Supplier Device Package: 0402; Size / Dimension: 0.039" L x 0.020" W (1.00mm x 0.50mm); Height - Seated (Max): 0.016" (0.40mm); Number of Terminations: 2; Failure Rate: -

## Sheet I2C_DRIVER.SchDoc
size A4; SheetNumber: 5; SheetTotal: 7
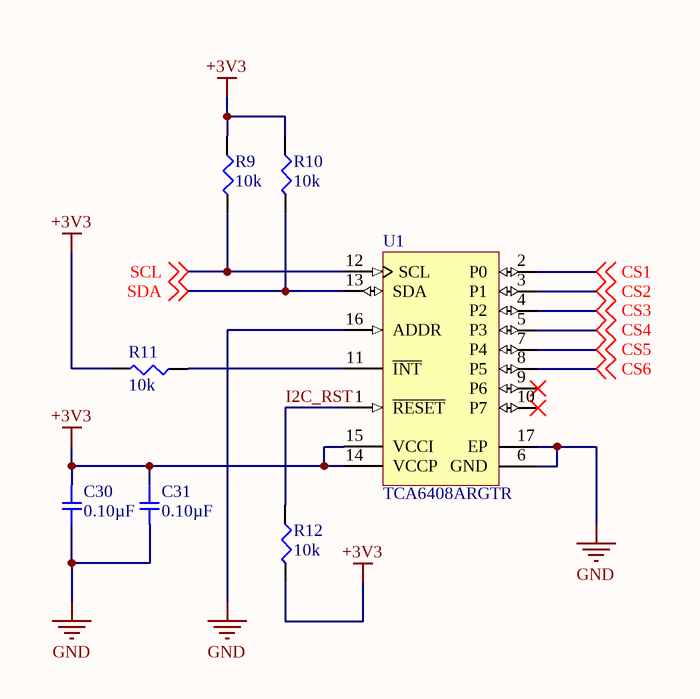
[diagram p4: I2C_DRIVER.SchDoc]

### Parts
C30  0.10µF  [SMD-0402C]
C31  0.10µF  [SMD-0402C]
R9  10k  [SMD-0402-RES]
R10  10k  [SMD-0402-RES]
R11  10k  [SMD-0402-RES]
R12  10k  [SMD-0402-RES]
U1  TCA6408ARGTR  [RGT0016A_V]

### Nets
+3V3: C30.1 C31.1 R9.1 R10.1 R11.2 R12.2 U1.14(VCCP) U1.15(VCCI)
GND: C30.2 C31.2 U1.6(GND) U1.16(ADDR) U1.17(EP)
CS1: U1.2(P0) ; off-sheet CS1
CS2: U1.3(P1) ; off-sheet CS2
CS3: U1.4(P2) ; off-sheet CS3
CS4: U1.5(P3) ; off-sheet CS4
CS5: U1.7(P4) ; off-sheet CS5
CS6: U1.8(P5) ; off-sheet CS6
I2C_RST: R12.1 U1.1(~{RESET})
SCL: R9.2 U1.12(SCL) ; off-sheet SCL
SDA: R10.2 U1.13(SDA) ; off-sheet SDA
NetR11_1: R11.1 U1.11(~{INT})

Not connected (* = marked no-connect by the designer): U1 9(P6)* 10(P7)*

### Library data of the parts
C30 C31 = GCM155R71C104KA55D: as C1 on sheet MCU; Datasheets: http://www.murata.com/~/media/webrenewal/support/library/catalog/products/capacitor/mlcc/c03e.ashx; Image: //media.digikey.com/Renders/Murata%20Renders/ZRB-SERIES-0402.jpg; Digi-Key Part Number: 490-4759-1-ND; Part Number: GCM155R71C104KA55D; Quantity Available: 734194; @ qty: 0; Packaging: Cut Tape (CT); Series: GCM; Part Status: Active; Value: 0.10µF; Voltage: 16V; Temperature Coefficient: X7R; Operating Temperature: -55°C ~ 125°C; Features: -; Ratings: AEC-Q200; Applications: Automotive; Mounting Type: Surface Mount, MLCC; Package / Case: 0402 (1005 Metric); Size / Dimension: 0.039" L x 0.020" W (1.00mm x 0.50mm); Height - Seated (Max): -; Thickness (Max): 0.022" (0.55mm); Lead Spacing: -; Lead Style: -
R9-R12 = ERJ-2GEJ103X: as R1 on sheet MCU; Part Number: ERJ-2GEJ103X; Datasheets: http://industrial.panasonic.com/www-cgi/jvcr13pz.cgi?E+PZ+3+AOA0001+ERJ2GEJ103X+7+WW; Image: //media.digikey.com/Photos/Panasonic%20Photos/ERJ-PA2-Series.jpg; Digi-Key Part Number: P10KJCT-ND; Quantity Available: 2560215; Packaging: Cut Tape (CT); Series: ERJ; Part Status: Active; Value: 10k; Tolerance: ±5%; Composition: Thick Film; Features: Automotive AEC-Q200; Operating Temperature: -55°C ~ 155°C; Package / Case: 0402 (1005 Metric); Supplier Device Package: 0402; Size / Dimension: 0.039" L x 0.020" W (1.00mm x 0.50mm); Height - Seated (Max): 0.016" (0.40mm); Number of Terminations: 2; Failure Rate: -
U1 = CMP-0314-00034-2: Low-Voltage 8-Bit I2C and SMBus I/O Expander, 1.65 to 5.5 V, -40 to 85 degC, 16-pin QFN (RGT), Green (RoHS & no Sb/Br); Manufacturer: Texas Instruments; Max Frequency(kHz): 400; Low Power: Yes; I2C Address: 0100 00x; # of I/Os: 8; VCC(Max)(V): 5.5; SubFamily: I2C IO Expander; VCC(Min)(V): 1.65; fSCLK(Max)(MHz): 400; ComponentLink2Description: Package Specification; PackageDescription: 16-Pin Plastic Quad Flat No-Lead, 3 x 3 mm Body, 0.5 mm Pitch, 1.45 x 1.45 mm Exposed Pad; Code_JEDEC: MO-220; PackageReference: RGT0016A; Interrupt Output: Yes; PartNumber: TCA6408ARGTR; No. of Outputs: 8; ComponentLink2URL: http://www.ti.com/litv/pdf/mpds361; Push-Pull I/O Type: Yes; Reset Input: Yes; DatasheetVersion: SCPS192C; ComponentLink1Description: Datasheet; Eco-Plan: Green (RoHS & no Sb/Br); 5V Tolerant I/O: Yes; PackageVersion: revH, Oct-2011; Mounting Technology: Surface Mount; Vcc range(V): 1.65 to 5.5; ComponentLink1URL: http://www.ti.com/general/docs/lit/getliterature.tsp?genericPartNumber=TCA6408A&fileType=pdf; Configuration Registers: Yes

## Sheet RTC.SchDoc
size A4; SheetNumber: 6; SheetTotal: 7
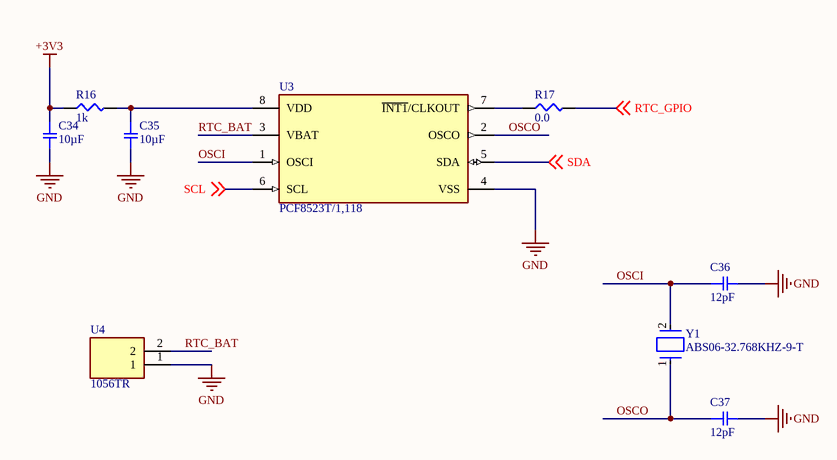
[diagram p5: RTC.SchDoc]

### Parts
C34  10µF  [SMD-0402C]
C35  10µF  [SMD-0402C]
C36  12pF  [SMD-0402C]
C37  12pF  [SMD-0402C]
R16  1k  [SMD-0402-RES]
R17  0.0  [SMD-0402-RES]
U3  PCF8523T/1,118  [FP-SOT96-1-IPC_B]
U4  1056TR  [1056TR]
Y1  ABS06-32.768KHZ-9-T  [FP-ABS06-MFG]

### Nets
+3V3: C34.1 R16.1
GND: C34.2 C35.2 C36.2 C37.2 U3.4(VSS) U4.1
OSCI: C36.1 U3.1(OSCI) Y1.2
OSCO: C37.1 U3.2(OSCO) Y1.1
RTC_BAT: U3.3(VBAT) U4.2
RTC_GPIO: R17.2 ; off-sheet RTC_GPIO
SCL: U3.6(SCL) ; off-sheet SCL
SDA: U3.5(SDA) ; off-sheet SDA
NetC35_1: C35.1 R16.2 U3.8(VDD)
NetR17_1: R17.1 U3.7(~{INT1}/CLKOUT)

### Library data of the parts
C34 C35 = GRJ155R60J106ME11D: CAP CER 10UF 6.3V X5R 0402; Manufacturer: Murata Electronics North America; Factory Stock: 0; Unit Price (USD): 0.23; Minimum Quantity: 1; Tolerance: ±20%; Datasheets: http://psearch.en.murata.com/capacitor/product/GRJ155R60J106ME11%23.pdf; Image: //media.digikey.com/Renders/Murata%20Renders/ZRB-SERIES-0402.jpg; Digi-Key Part Number: 490-13211-1-ND; Part Number: GRJ155R60J106ME11D; Quantity Available: 64064; @ qty: 0; Packaging: Cut Tape (CT); Series: GRJ; Part Status: Active; Value: 10µF; Voltage: 6.3V; Temperature Coefficient: X5R; Operating Temperature: -55°C ~ 85°C; Features: Derating Recommended, Soft Termination; Ratings: -; Applications: Boardflex Sensitive; Mounting Type: Surface Mount, MLCC; Package / Case: 0402 (1005 Metric); Size / Dimension: 0.039" L x 0.020" W (1.00mm x 0.50mm); Height - Seated (Max): -; Thickness (Max): 0.028" (0.70mm); Lead Spacing: -; Lead Style: -
C36 C37 = GCM1555C1H120JA16D: CAP CER 12PF 50V NP0 0402; Manufacturer: Murata Electronics North America; Factory Stock: 0; Unit Price (USD): 0.1; Minimum Quantity: 1; Tolerance: ±5%; Temperature Coefficient: C0G, NP0; Datasheets: http://www.murata.com/~/media/webrenewal/support/library/catalog/products/capacitor/mlcc/c03e.ashx; Image: //media.digikey.com/Renders/Murata%20Renders/ZRB-SERIES-0402.jpg; Digi-Key Part Number: 490-12649-1-ND; Part Number: GCM1555C1H120JA16D; Quantity Available: 29045; @ qty: 0; Packaging: Cut Tape (CT); Series: GCM; Part Status: Active; Value: 12pF; Voltage: 50V; Operating Temperature: -55°C ~ 125°C; Features: -; Ratings: AEC-Q200; Applications: Automotive; Mounting Type: Surface Mount, MLCC; Package / Case: 0402 (1005 Metric); Size / Dimension: 0.039" L x 0.020" W (1.00mm x 0.50mm); Height - Seated (Max): -; Thickness (Max): 0.022" (0.55mm); Lead Spacing: -; Lead Style: -
R16 = ERJ-2GEJ102X: RES SMD 1K OHM 5% 1/10W 0402; Manufacturer: Panasonic Electronic Components; Factory Stock: 0; Unit Price (USD): 0.00350; @ qty: 1500; Minimum Quantity: 1; Power (Watts): 0.1W, 1/10W; Temperature Coefficient: ±200ppm/°C; Part Number: ERJ-2GEJ102X; Datasheets: http://industrial.panasonic.com/www-cgi/jvcr13pz.cgi?E+PZ+3+AOA0001+ERJ2GEJ102X+7+WW; Image: //media.digikey.com/Photos/Panasonic%20Photos/ERJ-PA2-Series.jpg; Digi-Key Part Number: P1.0KJCT-ND; Quantity Available: 1939857; Packaging: Cut Tape (CT); Series: ERJ; Part Status: Active; Value: 1k; Tolerance: ±5%; Composition: Thick Film; Features: Automotive AEC-Q200; Operating Temperature: -55°C ~ 155°C; Package / Case: 0402 (1005 Metric); Supplier Device Package: 0402; Size / Dimension: 0.039" L x 0.020" W (1.00mm x 0.50mm); Height - Seated (Max): 0.016" (0.40mm); Number of Terminations: 2; Failure Rate: -
R17 = ERJ-2GE0R00X: as R2 on sheet MCU; Part Number: ERJ-2GE0R00X; Datasheets: http://industrial.panasonic.com/www-cgi/jvcr13pz.cgi?E+PZ+3+AOA0001+ERJ2GE0R00X+7+WW; Image: //media.digikey.com/Photos/Panasonic%20Photos/ERJ-PA2-Series.jpg; Digi-Key Part Number: P0.0JCT-ND; Quantity Available: 3152483; Packaging: Cut Tape (CT); Series: ERJ; Part Status: Active; Value: 0.0; Tolerance: Jumper; Composition: Thick Film; Features: Automotive AEC-Q200; Temperature Coefficient: -; Operating Temperature: -55°C ~ 155°C; Package / Case: 0402 (1005 Metric); Supplier Device Package: 0402; Size / Dimension: 0.039" L x 0.020" W (1.00mm x 0.50mm); Height - Seated (Max): 0.016" (0.40mm); Number of Terminations: 2; Failure Rate: -
U3 = CMP-10083-000014-1: IC RTC CLK/CALENDAR I2C 8-SOIC; Time Format: HH:MM:SS; Min Supply Voltage: 1.2V; Max Supply Voltage: 5.5V; Logic Function: Clock; Min Operating Temperature: -40°C; Case/Package: SO; Radiation Hardening: No; Interface: I2C; Max Operating Temperature: 85°C; Contact Plating: Gold; Packaging: Tape and Reel; Package Quantity: 2500; Lead Free: Lead Free; Number of Pins: 8; Mount: Surface Mount; REACH SVHC: No SVHC
U4 = 1056TR: Undefined or Miscellaneous; Manufacturer_Name: Keystone Electronics; Datasheet Link: http://www.keyelco.com/product-pdf.cfm?p=4028; Manufacturer_Part_Number: 1056TR; Mouser Part Number: 534-1056TR; Mouser Price/Stock: https://www.mouser.co.uk/ProductDetail/Keystone-Electronics/1056TR?qs=sZfk%252BfAlGe6t6AyLJNcPdQ%3D%3D
Y1 = CMP-27762-015421-1: Crystal 32.768kHz ±20ppm (Tol) 9pF FUND 90kΩ 2-Pin Mini-CSMD T/R; ESR (Equivalent Series Resistance): 90kR; Max Operating Temperature: 85°C; Frequency Tolerance: 20ppm; Case/Package: CSMD; Termination: SMD/SMT; RoHS Compliant: Yes; Height: 0.6mm; Load Capacitance: 9pF; Packaging: Tape and Reel; Depth: 1.2mm; Tolerance: 20ppm; Frequency: 32.768kHz; Series: ABS06; Width: 1.2mm; Length: 2mm; Number of Pins: 2; Min Operating Temperature: -40°C; Mount: Surface Mount; Lead Free: Lead Free; Package Quantity: 3000